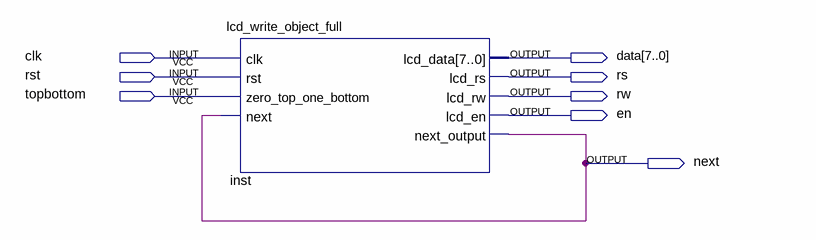
[diagram p0: schematic sheet]
// Quartus schematic write_test.bdf as structural Verilog: 1 symbols, 8 pins
module write_test (
  input  clk,
  input  rst,
  input  topbottom,
  output [7:0] data,
  output rs,
  output rw,
  output en,
  output next
);

  lcd_write_object_full inst (
    .clk(clk), .rst(rst), .zero_top_one_bottom(topbottom), .next(next), .lcd_data(data), .lcd_rs(rs),
    .lcd_rw(rw), .lcd_en(en), .next_output(next));
endmodule
